# EAGLE design Placa principal (EAGLE 7.6.0)
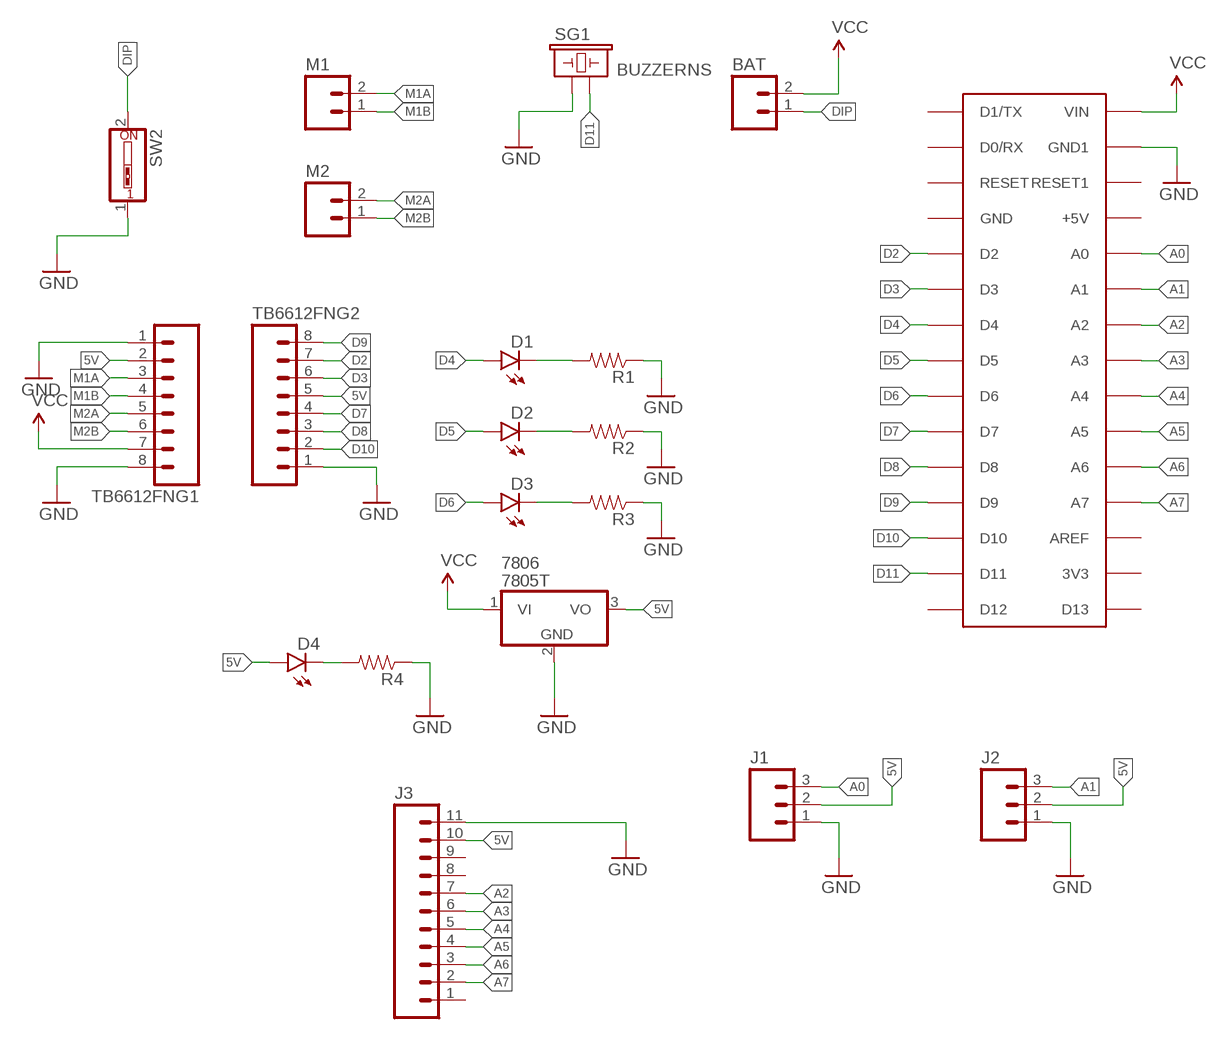
[diagram p0: schematic, sheet 1]

## Parts
7806  7805T  [TO220H]
BAT  M02PTH  [1X02]
D1  LED5MM  [LED5MM]
D2  LED5MM  [LED5MM]
D3  LED5MM  [LED5MM]
D4  LED5MM  [LED5MM]
J1  M03PTH  [1X03]
J2  M03PTH  [1X03]
J3  M11PTH  [1X11]
M1  M02JST-PTH-VERT  [JST-2-PTH-VERT]
M2  M02JST-PTH-VERT  [JST-2-PTH-VERT]
R1  RESISTOREZ  [AXIAL-0.3EZ]
R2  RESISTOREZ  [AXIAL-0.3EZ]
R3  RESISTOREZ  [AXIAL-0.3EZ]
R4  RESISTOREZ  [AXIAL-0.3EZ]
SG1  BUZZERNS  [BUZZER-12MM-NS]
SW2  SW_DIP-1  [EDG-01]
TB6612FNG1  M08  [1X08_ROUND]
TB6612FNG2  M08  [1X08_ROUND]
U$2  ARDUINONANO  [PDIP-32]

## Nets
5V: 7806.3(VO) D4.A J1.2 J2.2 J3.10 TB6612FNG1.2 TB6612FNG2.5
A0: J1.3 U$2.A0
A1: J2.3 U$2.A1
A2: J3.7 U$2.A2
A3: J3.6 U$2.A3
A4: J3.5 U$2.A4
A5: J3.4 U$2.A5
A6: J3.3 U$2.A6
A7: J3.2 U$2.A7
D2: TB6612FNG2.7 U$2.D2
D3: TB6612FNG2.6 U$2.D3
D4: D1.A U$2.D4
D5: D2.A U$2.D5
D6: D3.A U$2.D6
D7: TB6612FNG2.4 U$2.D7
D8: TB6612FNG2.3 U$2.D8
D9: TB6612FNG2.8 U$2.D9
D10: TB6612FNG2.2 U$2.D10
D11: SG1.- U$2.D11
DIP: BAT.1 SW2.2
GND: 7806.2(GND) J1.1 J2.1 J3.11 R1.P$1 R2.P$1 R3.P$1 R4.P$1 SG1.+ SW2.1 TB6612FNG1.1 TB6612FNG1.8 TB6612FNG2.1 U$2.GND1
M1A: M1.2 TB6612FNG1.3
M1B: M1.1 TB6612FNG1.4
M2A: M2.2 TB6612FNG1.5
M2B: M2.1 TB6612FNG1.6
N$2: D4.K(C) R4.P$2
N$4: D1.K(C) R1.P$2
N$5: D2.K(C) R2.P$2
N$6: D3.K(C) R3.P$2
VCC: 7806.1(VI) BAT.2 TB6612FNG1.7 U$2.VIN
Unconnected: J3.1 J3.8 J3.9 U$2.3V3 U$2.+5V U$2.AREF U$2.D0/RX U$2.D1/TX U$2.D12 U$2.D13 U$2.GND U$2.RESET U$2.RESET1

## Library data of the parts
7806 = linear:78*: Positive VOLTAGE REGULATOR Source: http://cache.national.com/ds/LM/LM78L05.pdf http://www.fairchildsemi.com/ds/LM/LM7805.pdf
BAT M1 M2 = SparkFun-Connectors:M02: Standard 2-pin 0.1" header. Use with - straight break away headers ( PRT-00116) - right angle break away headers (PRT-00553) - swiss pins (PRT-00743) - machine pins (PRT-00117) - female headers (PRT-00115) Molex polarized connector foot print use with: PRT-08233 with associated crimp pins and housings. 2.54_SCREWTERM for use with PRT-10571. 3.5mm Screw Terminal footprints for PRT-08084 5mm Screw Terminal footprints for use with PRT-08432
D1-D4 = SparkFun-LED:LED: LEDs Standard schematic elements and footprints for 5mm, 3mm, 1206, and 0603 sized LEDs. 5mm - Spark Fun Electronics SKU : COM-00529 (and others)
J1 J2 = SparkFun-Connectors:M03: Header 3 Standard 3-pin 0.1" header. Use with straight break away headers (SKU : PRT-00116), right angle break away headers (PRT-00553), swiss pins (PRT-00743), machine pins (PRT-00117), and female headers (PRT-00115). Molex polarized connector foot print use with SKU : PRT-08232 with associated crimp pins and housings.
J3 = SparkFun-Connectors:M11: Header 11 Standard 11-pin 0.1" header. Use with straight break away headers (SKU : PRT-00116), right angle break away headers (PRT-00553), swiss pins (PRT-00743), machine pins (PRT-00117), and female headers (PRT-00115).
R1-R4 = SparkFun-Resistors:RESISTOR: Resistor Basic schematic elements and footprints for 0603, 1206, and PTH resistors.
SG1 = SparkFun-Electromechanical:BUZZER: Buzzer 12mm Spark Fun Electronics SKU : Comp-Buzzer
SW2 = special:SW_DIP-1: DIP SWITCH
TB6612FNG1 TB6612FNG2 = SparkFun-Connectors:M08: Header 8 Standard 8-pin 0.1" header. Use with straight break away headers (SKU : PRT-00116), right angle break away headers (PRT-00553), swiss pins (PRT-00743), machine pins (PRT-00117), and female headers (PRT-00115).; PROD_ID: CONN-08437
U$2 = jet-lib:ARDUINONANO

## Board
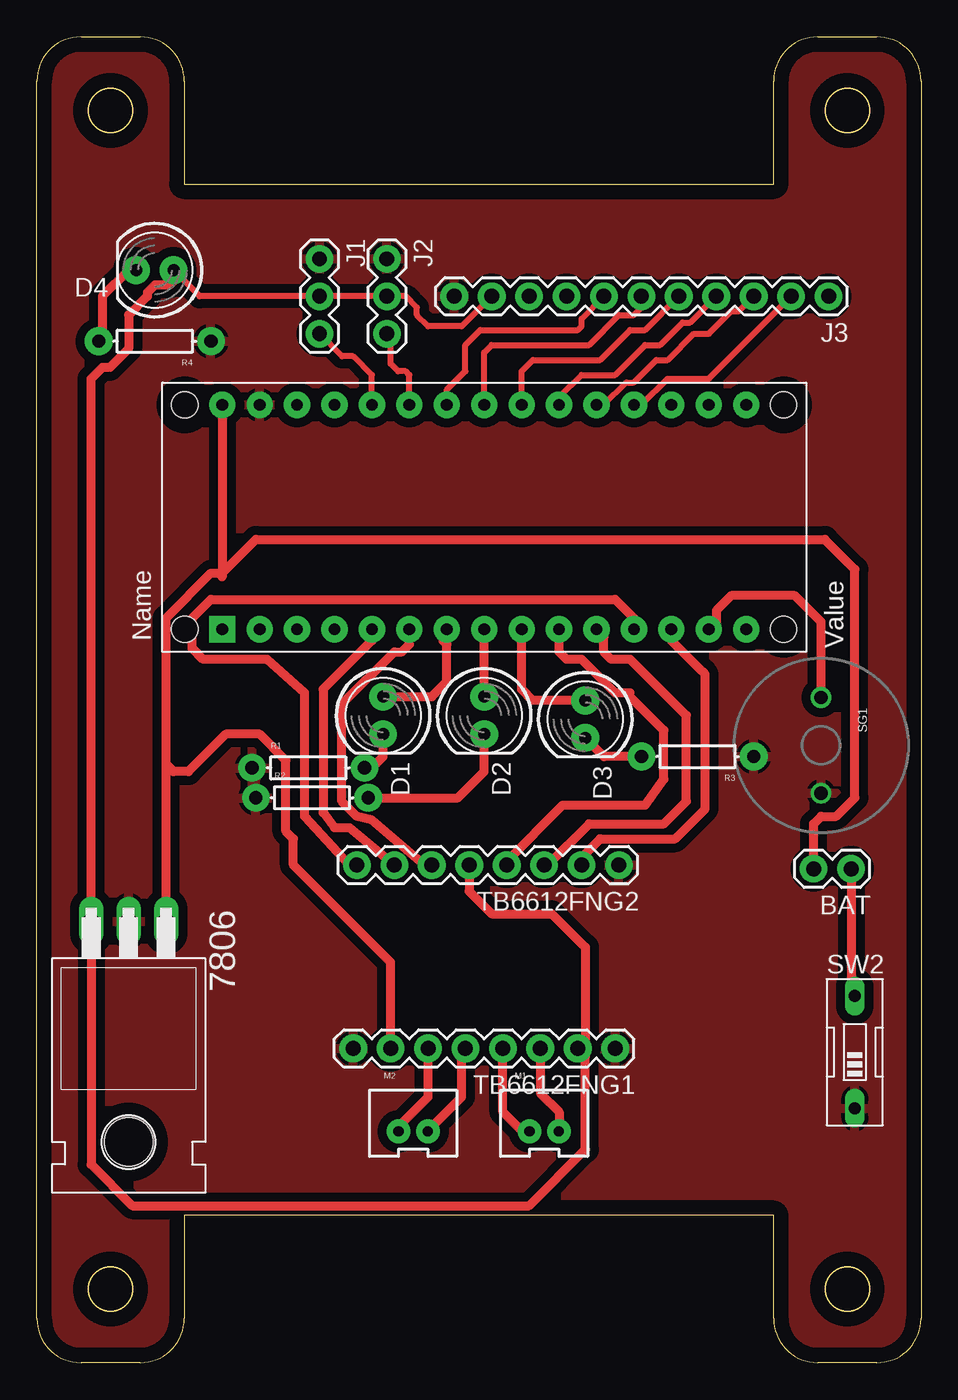
[diagram p1: board, top side]

Size 60 x 90 mm. Coordinates in mm from the lower left corner, seen from the top.
Outline: 53,90 57,90 arc-90 60,87 60,3 arc-90 57,0 53,0 arc-90 50,3 50,10 10,10 10,3 arc-90 7,0 3,0 arc-90 0,3 0,87 arc-90 3,90 7,90 arc-90 10,87 10,80 50,80 50,87 arc-90 53,90
Outline: circle at 5,85 radius 1.5
Outline: circle at 55,5 radius 1.5
Outline: circle at 55,85 radius 1.5
Outline: circle at 5,5 radius 1.5
Copper layers (1*16): Top 0.035mm / dielectric 1.5mm / Bottom 0.035mm
Design rules "default": minimum track width 10mil, minimum drill 24mil, track to track 8mil, track to pad 8mil, pad to pad 8mil, via to via 8mil, smd to smd 8mil, copper to edge 40mil, drill to drill 8mil, minimum pad ring 10mil, minimum via ring 8mil, stop-mask expansion 4mil, vias tented up to drill 0mil, thermal gap 10mil

### Footprints (pad centres in the part's own frame; a part is rotated, then mirrored left to right if it is on the bottom)
TO220H = drill 1.118 long: 1 -2.54,-10.16; 2 0,-10.16; 3 2.54,-10.16 | hole 3.302: 0,4.826
1X02 = drill 1.016 pad 1.88: 1 0,0; 2 2.54,0
LED5MM = drill 0.813 pad 1.88: A -1.27,0; K 1.27,0
1X03 = drill 1.016 pad 1.88: 1 0,0; 2 2.54,0; 3 5.08,0
1X11 = drill 1.016 pad 1.88: 1 0,0; 2 2.54,0; 3 5.08,0; 4 7.62,0; 5 10.16,0; 6 12.7,0; 7 15.24,0; 8 17.78,0; 9 20.32,0; 10 22.86,0; 11 25.4,0
JST-2-PTH-VERT = drill 0.7 pad 1.6: 1 -1,-0.55; 2 1,-0.55
AXIAL-0.3EZ = drill 0.9 pad 1.88: P$1 -3.81,0; P$2 3.81,0
BUZZER-12MM-NS = drill 0.9: + 3.25,0; - -3.25,0
EDG-01 = drill 0.813 long: 1 0,-3.81; 2 0,3.81
1X08_ROUND = drill 1.016 pad 1.88: 1 0,0; 2 2.54,0; 3 5.08,0; 4 7.62,0; 5 10.16,0; 6 12.7,0; 7 15.24,0; 8 17.78,0
PDIP-32 = drill 0.8 pad 1.778: 3V3 15.24,-35.56; +5V 15.24,-10.16; A0 15.24,-12.7; A1 15.24,-15.24; A2 15.24,-17.78; A3 15.24,-20.32; A4 15.24,-22.86; A5 15.24,-25.4; A6 15.24,-27.94; A7 15.24,-30.48; AREF 15.24,-33.02; D0/RX 0,-5.08; D2 0,-12.7; D3 0,-15.24; D4 0,-17.78; D5 0,-20.32; D6 0,-22.86; D7 0,-25.4; D8 0,-27.94; D9 0,-30.48; D10 0,-33.02; D11 0,-35.56; D12 0,-38.1; D13 15.24,-38.1; GND 0,-10.16; GND1 15.24,-5.08; RESET 0,-7.62; RESET1 15.24,-7.62; VIN 15.24,-2.54 | drill 0.8 pad 1.778 square: D1/TX 0,-2.54 | hole 1.778: 0,0; 0,-40.64; 15.24,-40.64; 15.24,0

### Placement (x,y rotation side)
7806  6.23,19.81 180 top
BAT  55.25,33.52 180 top
D1  23.5,43.94 270 top
D2  30.36,43.94 270 top
D3  37.21,43.68 270 top
D4  8,74.16 180 top
J1  19.18,74.93 270 top
J2  23.75,74.93 270 top
J3  53.72,72.39 180 top
M1  34.42,16.25 0 top
M2  25.53,16.25 0 top
R1  18.42,40.38 0 top
R2  18.67,38.35 0 top
R3  44.83,41.14 180 top
R4  8,69.34 180 top
SG1  53.22,41.91 270 top
SW2  55.5,21.08 0 top
TB6612FNG1  39.25,21.33 180 top
TB6612FNG2  39.5,33.78 180 top
U$2  10.04,49.78 90 top

### Tracks (layer width: path | path; a pad name or v marks a point on that pad's centre or on a via)
5V
  Top 0.406: D4.A 11.05,72.39 J1.2 J2.2 25.02,72.39 25.78,71.62 25.78,71.12 26.55,70.35 28.83,70.35 J3.10
  Top 0.61: D4.A 9.66,73.78 9.02,73.15 8,73.15 7.5,72.64 7.5,72.39 6.23,71.12 6.23,68.83 4.96,67.56 4.45,67.56 3.69,66.8 7806.3 3.69,13.46 6.48,10.66 33.4,10.66 37.21,14.47 37.21,20.82 TB6612FNG1.2 37.21,21.84 37.21,28.19 34.93,30.48 30.86,30.48 29.34,32 TB6612FNG2.5
A0
  Top 0.406: U$2.A0 22.74,67.05 21.47,68.32 20.7,68.32 J1.3
A1
  Top 0.406: U$2.A1 25.28,67.05 25.02,67.31 24.51,67.31 24.01,67.81 24.01,69.59 J2.3
A2
  Top 0.406: U$2.A2 27.82,66.04 29.09,67.31 29.09,69.08 30.1,70.1 36.71,70.1 36.96,70.35 36.96,70.86 J3.7
A3
  Top 0.406: U$2.A3 30.36,68.58 30.86,69.08 37.47,69.08 39.5,71.12 40.52,71.12 41.02,71.62 J3.6
A4
  Top 0.406: U$2.A4 32.9,67.31 33.66,68.07 38.23,68.07 40.26,70.1 41.28,70.1 J3.5
A5
  Top 0.406: U$2.A5 35.44,65.53 36.96,67.05 39.25,67.05 41.28,69.08 42.29,69.08 43.82,70.61 44.33,70.61 J3.4
A6
  Top 0.406: U$2.A6 38.48,65.02 40.01,66.54 40.52,66.54 42.04,68.07 42.8,68.07 44.58,69.85 45.6,69.85 47.12,71.37 47.63,71.37 J3.3
A7
  Top 0.406: U$2.A7 41.02,65.02 42.8,66.8 45.6,66.8 J3.2
D2
  Top 0.61: U$2.D2 22.74,49.02 19.43,45.72 19.43,37.33 20.2,36.32 21.21,36.32 TB6612FNG2.7
D3
  Top 0.61: TB6612FNG2.6 26.29,33.78 22.74,36.83 21.72,37.08 20.7,38.1 20.7,44.7 24.26,48.26 24.77,48.26 25.28,48.76 U$2.D3
D4
  Top 0.61: D1.A 26.8,45.21 27.82,46.22 27.82,48.76 27.56,49.02 27.56,49.53 U$2.D4
D5
  Top 0.61: D2.A U$2.D5
D6
  Top 0.61: D3.A 33.66,44.95 32.9,45.72 U$2.D6
D7
  Top 0.61: TB6612FNG2.4 31.88,34.03 35.69,37.84 41.28,37.84 42.55,39.62 42.55,42.92 40.01,45.46 | 40.26,45.46 40.01,45.46 | 40.01,45.46 39.25,45.46 36.96,47.75 35.94,47.75 35.44,48.26 U$2.D7
D8
  Top 0.61: TB6612FNG2.3 34.67,33.78 37.47,36.57 42.55,36.57 44.07,38.1 44.07,43.94 40.26,47.75 38.99,47.75 38.48,48.26 38.48,49.27 U$2.D8
D9
  Top 0.61: U$2.D9 40.52,50.54 39.25,51.81 11.81,51.81 10.54,50.54 10.54,48.51 11.31,47.75 15.62,47.75 18.16,45.46 18.16,37.08 21.21,33.78 TB6612FNG2.8
D10
  Top 0.61: U$2.D10 43.06,49.02 44.96,47.11 45.34,46.73 45.34,37.59 43.31,35.56 38.23,35.56 36.96,34.29 TB6612FNG2.2
D11
  Top 0.61: SG1.- 53.22,50.29 51.44,52.07 47.12,52.07 46.1,51.05 46.1,50.29 U$2.D11
DIP
  Top 0.61: BAT.1 55.25,25.14 SW2.2
GND
  pour Top (isolate 0.61): -3.17,-1.78 66.68,-1.02 64.14,91.44 -3.17,91.18
M1A
  Top 0.61: TB6612FNG1.3 34.17,18.28 35.44,17.01 35.44,15.72 M1.2
M1B
  Top 0.61: M1.1 32.94,15.7 31.63,17.01 TB6612FNG1.4
M2A
  Top 0.61: M2.2 26.53,15.73 28.83,18.03 28.83,21.08 TB6612FNG1.5
M2B
  Top 0.61: M2.1 24.53,16.01 26.55,18.03 TB6612FNG1.6
N$2
  Top 0.61: D4.K 6.23,74.16 4.45,72.39 4.45,69.59 R4.P$2
N$4
  Top 0.61: R1.P$2 22.74,40.38 23.5,41.14 D1.K
N$5
  Top 0.61: R2.P$2 28.58,38.35 30.36,40.13 D2.K
N$6
  Top 0.61: R3.P$2 38.48,41.14 D3.K
VCC
  Top 0.61: U$2.VIN 12.58,53.59 | 12.58,53.59 12.58,53.34 | BAT.2 52.71,36.57 53.22,37.08 54.23,37.08 55.5,38.35 55.5,53.84 53.47,55.88 14.86,55.88 12.58,53.59 | 12.58,53.59 11.81,53.59 8.77,50.54 7806.1 8.77,40.64 9.27,40.13 10.29,40.13 12.83,42.67 15.12,42.67 16.89,40.89 16.89,36.06 17.4,35.56 17.4,33.78 24.01,27.17 TB6612FNG1.7